# EAGLE design IR_Emitter_Card (EAGLE 6.4)

## Sheet 1 of 2
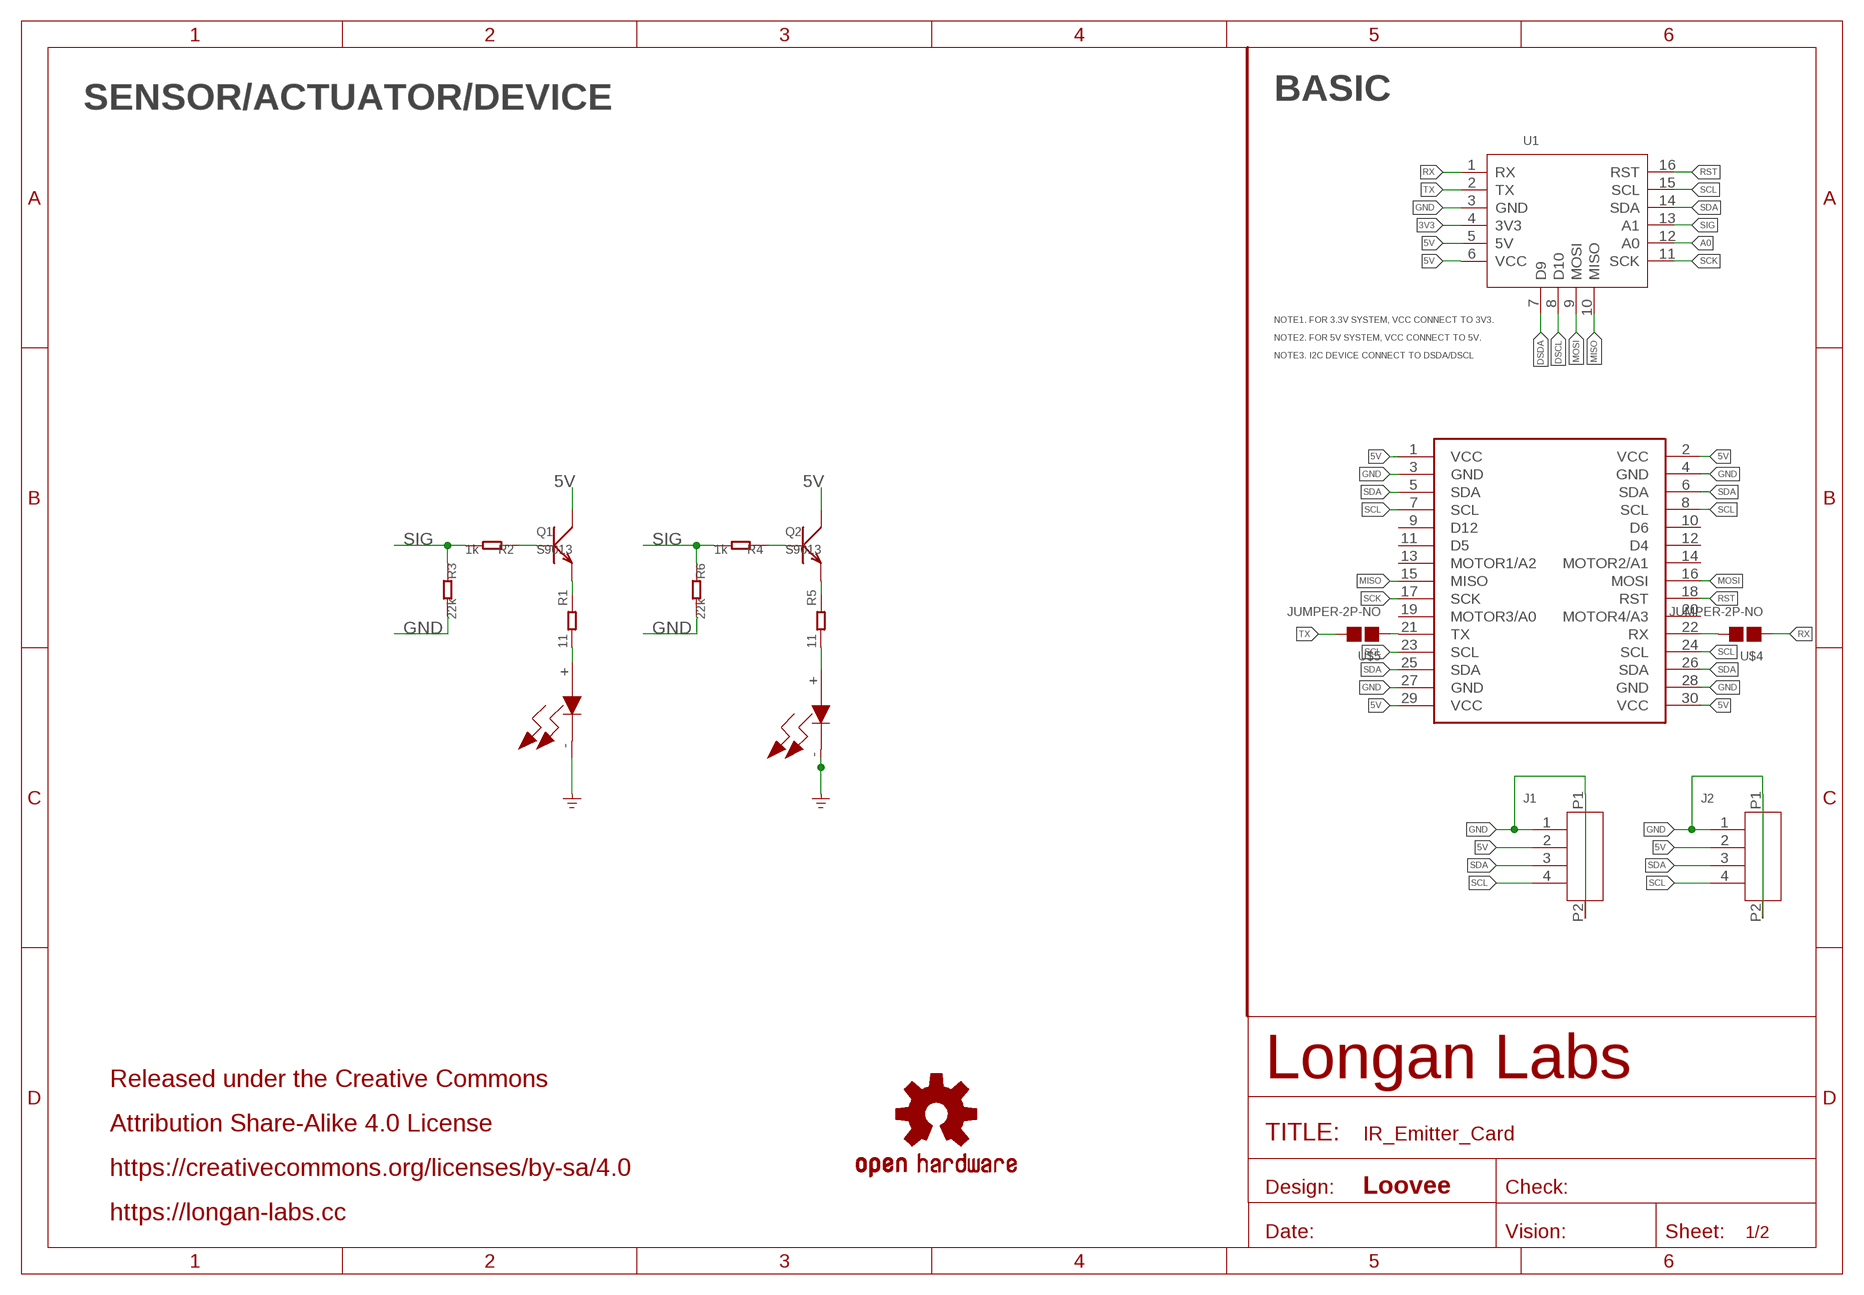
[diagram p0: schematic, sheet 1]

### Parts
J1  HEADER-4P-1.0  [4P-1.0-90D]
J2  HEADER-4P-1.0  [4P-1.0-90D]
LOGO2  OSHW-LOGOS  [OSHW-LOGO-S]
MOUDLE1  MOUDLE-2X15P-2.54'BOARD'  [MOUDLE-2X15P-2.54]
Q1  S9013  TRANSISTOR-NPN-SOT23''  [SOT23]
Q2  S9013  TRANSISTOR-NPN-SOT23''  [SOT23]
R1  11  R-0805  [0805]
R2  1k  R-0603  [0603]
R3  22k  R-0603  [0603]
R4  1k  R-0603  [0603]
R5  11  R-0805  [0805]
R6  22k  R-0603  [0603]
U1  MOUDLE-CARDS  [16P-2.0-CARDS]
U$4  JUMPER-2P-NO  [2P-SMD-NO]
U$5  JUMPER-2P-NO  [2P-SMD-NO]
U$8  SENSOR-IR26  [2P-SMD-3.0X1.2MM]
U$9  SENSOR-IR26'90D'  [2P-SMD-3.0X1.2MM-90D]

### Nets
3V3: U1.4(3V3)
5V: J1.2 J2.2 MOUDLE1.1(VCC) MOUDLE1.2(VCC) MOUDLE1.29(VCC) MOUDLE1.30(VCC) Q1.3(C) Q2.3(C) U1.5(5V) U1.6(VCC)
A0: U1.12(A0)
DSCL: U1.8(D10)
DSDA: U1.7(D9)
GND: J1.1 J1.P1 J1.P2 J2.1 J2.P1 J2.P2 MOUDLE1.3(GND) MOUDLE1.4(GND) MOUDLE1.27(GND) MOUDLE1.28(GND) R3.2 R6.2 U1.3(GND) U$8.- U$9.- ; supply symbol labelled GND_POWER
MISO: MOUDLE1.15(MISO) U1.10(MISO)
MOSI: MOUDLE1.16(MOSI) U1.9(MOSI)
N$1: Q1.1(B) R2.1
N$2: Q1.2(E) R1.1
N$3: R1.2 U$8.+
N$4: MOUDLE1.22(RX) U$4.2
N$5: Q2.1(B) R4.1
N$6: MOUDLE1.21(TX) U$5.1
N$7: Q2.2(E) R5.1
N$8: R5.2 U$9.+
RST: MOUDLE1.18(RST) U1.16(RST)
RX: U1.1(RX) U$4.1
SCK: MOUDLE1.17(SCK) U1.11(SCK)
SCL: J1.4 J2.4 MOUDLE1.7(SCL) MOUDLE1.8(SCL) MOUDLE1.23(SCL) MOUDLE1.24(SCL) U1.15(SCL)
SDA: J1.3 J2.3 MOUDLE1.5(SDA) MOUDLE1.6(SDA) MOUDLE1.25(SDA) MOUDLE1.26(SDA) U1.14(SDA)
SIG: R2.2 R3.1 R4.2 R6.1 U1.13(A1)
TX: U1.2(TX) U$5.2
Unconnected: MOUDLE1.9(D12) MOUDLE1.10(D6) MOUDLE1.11(D5) MOUDLE1.12(D4) MOUDLE1.13(MOTOR1/A2) MOUDLE1.14(MOTOR2/A1) MOUDLE1.19(MOTOR3/A0) MOUDLE1.20(MOTOR4/A3)

### Notes on the sheet
- SENSOR/ACTUATOR/DEVICE | BASIC
- NOTE1. FOR 3.3V SYSTEM, VCC CONNECT TO 3V3.
- NOTE2. FOR 5V SYSTEM, VCC CONNECT TO 5V.
- NOTE3. I2C DEVICE CONNECT TO DSDA/DSCL
- Released under the Creative Commons
- Attribution Share-Alike 4.0 License
- https://creativecommons.org/licenses/by-sa/4.0
- Loovee
- https://longan-labs.cc

## Sheet 2 of 2

## Library data of the parts
J1 J2 = Longan-Connect:HEADER-4P-1.0
LOGO2 = SparkFun-Aesthetics:OSHW-LOGO: Open-Source Hardware (OSHW) Logo This logo indicates the piece of hardware it is found on incorporates a OSHW license and/or adheres to the definition of open source hardware found here: http://freedomdefined.org/OSHW
MOUDLE1 = Longan-moudle:MOUDLE-2X15P-2.54
Q1 Q2 = Discrete:TRANSISTOR-NPN*: NPN audion
R1-R6 = Discrete:R*
U1 = MOUDLE-CARDS:MOUDLE-CARDS
U$4 U$5 = Discrete-new:JUMPER-2P-NO
U$8 U$9 = LONGAN-DISCRETE:SENSOR-IR26

## Board
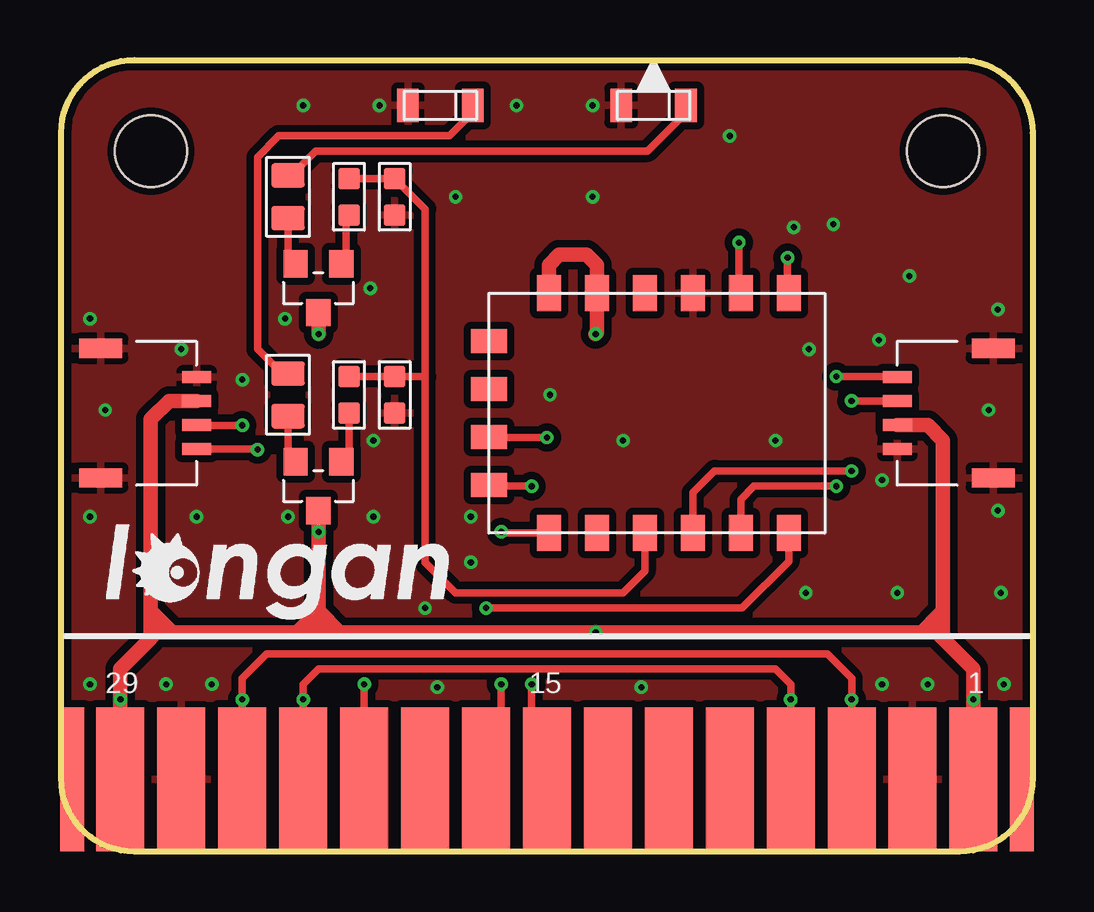
[diagram p1: board, top side]
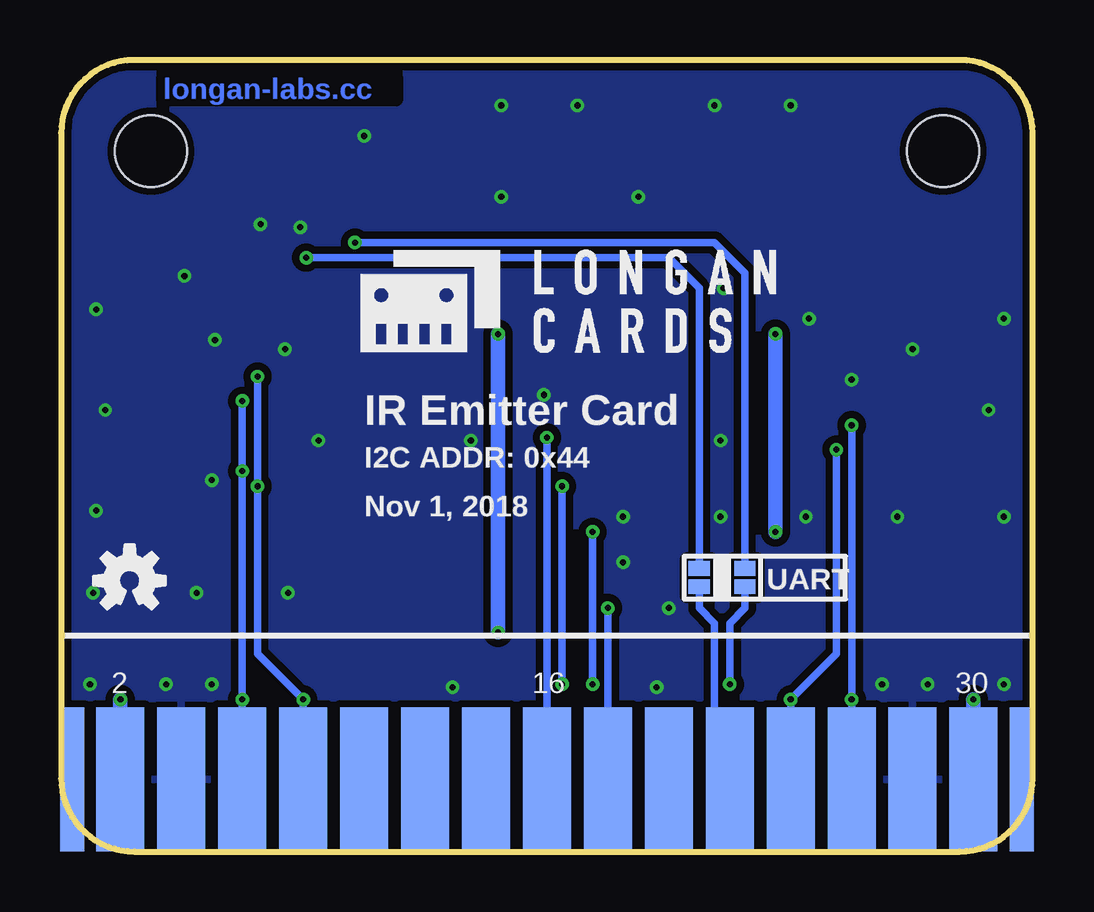
[diagram p2: board, bottom side, seen from below]

Size 40.5 x 33 mm. Coordinates in mm from the lower left corner, seen from the top.
Copper layers (1*16): Top 0.035mm / dielectric 1.5mm / Bottom 0.035mm
Design rules "SeeedStudio_2layer_DRU_no_angle_20140221 *": minimum track width 6mil, minimum drill 10mil, track to track 6mil, track to pad 6mil, pad to pad 6mil, via to via 6mil, smd to smd 0mil, copper to edge 10mil, drill to drill 10mil, minimum pad ring 10mil, minimum via ring 6mil, stop-mask expansion 2mil, vias tented up to drill 25mil, thermal gap 10mil

### Footprints (pad centres in the part's own frame; a part is rotated, then mirrored left to right if it is on the bottom)
4P-1.0-90D = smd 1.2 x 0.5: 1 0,1.5; 2 0,0.5; 3 0,-0.5; 4 0,-1.5 | smd 1.8 x 0.8: P1 -4,2.7; P2 -4,-2.7
MOUDLE-2X15P-2.54 = smd 2 x 6: 1 17.78,-13.492; 3 15.24,-13.492; 5 12.7,-13.492; 7 10.16,-13.492; 9 7.62,-13.492; 11 5.08,-13.492; 13 2.54,-13.492; 15 0,-13.492; 17 -2.54,-13.492; 19 -5.08,-13.492; 21 -7.62,-13.492; 23 -10.16,-13.492; 25 -12.7,-13.492; 27 -15.24,-13.492; 29 -17.78,-13.492 | smd 2 x 6 bottom: 2 17.78,-13.492; 4 15.24,-13.492; 6 12.7,-13.492; 8 10.16,-13.492; 10 7.62,-13.492; 12 5.08,-13.492; 14 2.54,-13.492; 16 0,-13.492; 18 -2.54,-13.492; 20 -5.08,-13.492; 22 -7.62,-13.492; 24 -10.16,-13.492; 26 -12.7,-13.492; 28 -15.24,-13.492; 30 -17.78,-13.492 | smd 1 x 6: P1 -19.8,-13.492; P4 19.8,-13.492 | smd 1 x 6 bottom: P2 -19.8,-13.492; P3 19.8,-13.492 | hole 3: -16.51,12.7; 16.51,12.7
SOT23 = smd 1.016 x 1.143: 1 -0.95,-1.016; 2 0.95,-1.016; 3 0,1.016
0805 = smd 1.016 x 1.397: 1 -0.889,0; 2 0.889,0
0603 = smd 0.889 x 0.889: 1 -0.762,0; 2 0.762,0
16P-2.0-CARDS = smd 1.5 x 1: 1 -5,5; 2 -5,3; 3 -5,1; 4 -5,-1; 5 -5,-3; 6 -5,-5; 11 5,-5; 12 5,-3; 13 5,-1; 14 5,1; 15 5,3; 16 5,5 | smd 1 x 1.5: 7 -3,-7.5; 8 -1,-7.5; 9 1,-7.5; 10 3,-7.5
2P-SMD-NO = smd 0.889 x 0.61: 1 0,0.381; 2 0,-0.381
2P-SMD-3.0X1.2MM = smd 0.9 x 1.4: + 1.35,0; - -1.35,0
2P-SMD-3.0X1.2MM-90D = smd 0.9 x 1.4: + 1.35,0; - -1.35,0

### Placement (x,y rotation side)
J1  5.64,18.28 0 top
J2  34.86,18.28 180 top
LOGO2  37.65,11.29 0 bottom
MOUDLE1  20.25,16.5 0 top
Q1  10.72,15.23 180 top
Q2  10.72,23.48 180 top
R1  9.46,19.04 90 top
R2  11.99,19.04 90 top
R3  13.9,19.04 270 top
R4  11.99,27.3 90 top
R5  9.46,27.3 90 top
R6  13.9,27.3 270 top
U1  25.33,18.28 270 top
U$1  [LONGAN-CARDS-MIDDLE]  28.76,20.31 0 bottom
U$2  [LONGAN-SILK-SMALLER]  0.57,8.5 0 top
U$4  13.9,11.42 0 bottom
U$5  11.99,11.42 180 bottom
U$8  15.8,31.11 0 top
U$9  24.7,31.11 0 top

### Tracks (layer width: path | path; a pad name or v marks a point on that pad's centre or on a via)
5V  (via drill 0.25 pad 0.51)
  Top 0.152: U1.6 20.33,23.95
  Top 0.61: MOUDLE1.30 v2.47,6.34 2.47,7.61 3.74,8.88 | 3.74,8.88 3.99,9.13 4.63,9.13 | 4.63,9.13 9.84,9.13 | 9.84,9.13 10.85,9.13 | 10.85,9.13 11.61,9.13 | 11.61,9.13 v22.28,9.13 35.87,9.13 | 35.87,9.13 36.51,9.13 36.76,8.88 | 36.76,8.88 38.03,7.61 v38.03,6.34 MOUDLE1.2 | 10.72,10.02 v10.72,13.32 Q1.3 | 10.72,10.02 10.72,9.26 10.85,9.13 | J1.2 4.49,18.78 3.74,18.02 3.74,10.02 | 3.74,10.02 3.74,8.88 | 11.61,9.13 10.72,10.02 | 10.72,10.02 9.84,9.13 | J2.2 36.12,17.78 36.76,17.14 36.76,8.88 | 35.87,9.13 36.63,9.9 | 4.63,9.13 3.74,10.02 | v22.28,21.58 22.33,21.63 U1.5 22.33,24.45 21.9,24.88 20.76,24.88 20.33,24.45 20.33,23.95 | Q2.3 v10.72,21.58
  Bottom 0.61: v38.03,6.34 MOUDLE1.2 | v2.47,6.34 MOUDLE1.30 | v22.28,21.58 v22.28,9.13 | v10.72,21.58 v10.72,13.32
GND  (via drill 0.25 pad 0.51)
  other vias: 34.22,6.97 36.12,6.97 39.3,6.97 4.38,6.97 1.2,6.97 1.84,18.41 6.28,6.97 1.2,13.96 1.2,22.21 5.01,20.95 20.38,19.04 38.66,18.41 39.05,22.6 39.05,14.21 34.22,15.48 34.09,21.33 30.54,26.02 31.17,20.95 32.19,26.15 35.36,23.99 39.17,10.79 13.01,17.14 13.01,13.96 17.07,13.96 17.07,12.05 15.17,10.15 9.46,13.96 7.55,19.68 5.64,13.96 29.77,17.14 23.43,17.14 31.05,10.79 34.86,10.79 24.19,6.85 15.68,6.85 9.33,22.21 13.27,31.11 10.09,31.11 22.16,31.11 18.98,31.11 16.44,27.3 12.88,23.48 22.16,27.3 27.87,29.84
  pour Top (isolate 0.305): -0.07,33.01 40.57,33.01 40.57,-0.01 -0.07,-0.01
  pour Bottom (isolate 0.305): -0.07,33.01 40.57,33.01 40.57,-0.01 -0.07,-0.01
MISO  (via drill 0.25 pad 0.51)
  Top 0.305: v19.61,6.97 19.61,3.64 MOUDLE1.15 | v19.61,15.23 17.88,15.23 U1.10
  Bottom 0.305: v19.61,15.23 v19.61,6.97
MOSI  (via drill 0.25 pad 0.51)
  Top 0.305: v20.25,17.26 17.85,17.26 U1.9
  Bottom 0.305: MOUDLE1.16 v20.25,17.26
N$1
  Top 0.305: R2.1 11.99,16.57 Q1.1
N$2
  Top 0.305: R1.1 9.46,16.57 Q1.2
N$3
  Top 0.305: R1.2 9.2,19.93 8.19,20.95 8.19,28.95 9.07,29.84 16.19,29.84 17.16,30.8 U$8.+
N$4
  Bottom 0.305: U$4.2 13.9,10.15 13.27,9.52 13.27,3.29 12.91,3.29 MOUDLE1.22
N$5
  Top 0.305: R4.1 11.87,26.53 11.87,24.69 Q2.1
N$6  (via drill 0.25 pad 0.51)
  Top 0.305: v12.63,6.97 MOUDLE1.21
  Bottom 0.305: U$5.1 11.99,10.15 12.63,9.52 v12.63,6.97
N$7
  Top 0.305: Q2.2 9.58,24.5 9.46,24.37 R5.1
N$8
  Top 0.305: R5.2 9.58,28.18 10.6,29.2 24.44,29.2 24.82,29.58 25.01,29.77 26.05,30.8 U$9.+
RST  (via drill 0.25 pad 0.51)
  Top 0.305: U1.16 30.33,12.1 28.38,10.15 v17.71,10.15
  Bottom 0.305: v17.71,10.15 MOUDLE1.18
RX  (via drill 0.25 pad 0.51)
  Top 0.305: v30.28,24.76 30.28,23.32 U1.1
  Bottom 0.305: U$4.1 13.9,23.48 15.17,24.76 v30.28,24.76
SCK  (via drill 0.25 pad 0.51)
  Top 0.305: U1.11 18.39,13.28 v18.34,13.32 | v18.34,6.97 18.34,3.64 MOUDLE1.17
  Bottom 0.305: v18.34,13.32 v18.34,6.97
SCL  (via drill 0.25 pad 0.51)
  Top 0.305: MOUDLE1.8 v30.41,6.34 30.41,6.97 29.77,7.61 10.72,7.61 10.09,6.97 v10.09,6.34 MOUDLE1.23 | J1.4 8.16,16.78 v8.19,16.75 | v32.31,19.8 34.83,19.8 J2.4 | U1.15 28.33,14.67 28.89,15.23 v32.31,15.23
  Bottom 0.305: MOUDLE1.23 v10.09,6.34 8.19,8.24 v8.19,16.75 | MOUDLE1.8 v30.41,6.34 30.41,6.47 30.54,6.47 32.31,8.24 v32.31,15.23 v32.31,19.8
SDA  (via drill 0.25 pad 0.51)
  Top 0.305: MOUDLE1.6 v32.95,6.34 32.95,7.23 31.93,8.24 8.57,8.24 7.55,7.23 v7.55,6.34 MOUDLE1.25 | v7.55,17.77 5.65,17.77 J1.3 | v32.95,18.79 34.85,18.79 J2.3 | U1.14 26.33,14.96 27.23,15.87 v32.95,15.87
  Bottom 0.305: MOUDLE1.25 v7.55,6.34 v7.55,17.77 | MOUDLE1.6 v32.95,6.34 32.95,15.36 v32.95,15.87 v32.95,18.79
SIG
  Top 0.305: U1.13 24.33,11.69 23.43,10.79 16.44,10.79 15.17,12.05 15.17,19.8 | R2.2 R3.1 15.17,19.8 | R4.2 R6.1 15.17,26.79 15.17,19.8
TX  (via drill 0.25 pad 0.51)
  Top 0.305: v28.25,25.39 28.25,23.36 U1.2
  Bottom 0.305: U$5.2 11.99,24.12 13.27,25.39 v28.25,25.39

### Text on the board
Bottom: longan-labs.cc
bPlace: IR Emitter Card | I2C ADDR: 0x44 | Nov 1, 2018 | UART